# EAGLE design simplePDschematicsv3_AZ_SMD (EAGLE 7.5.0)
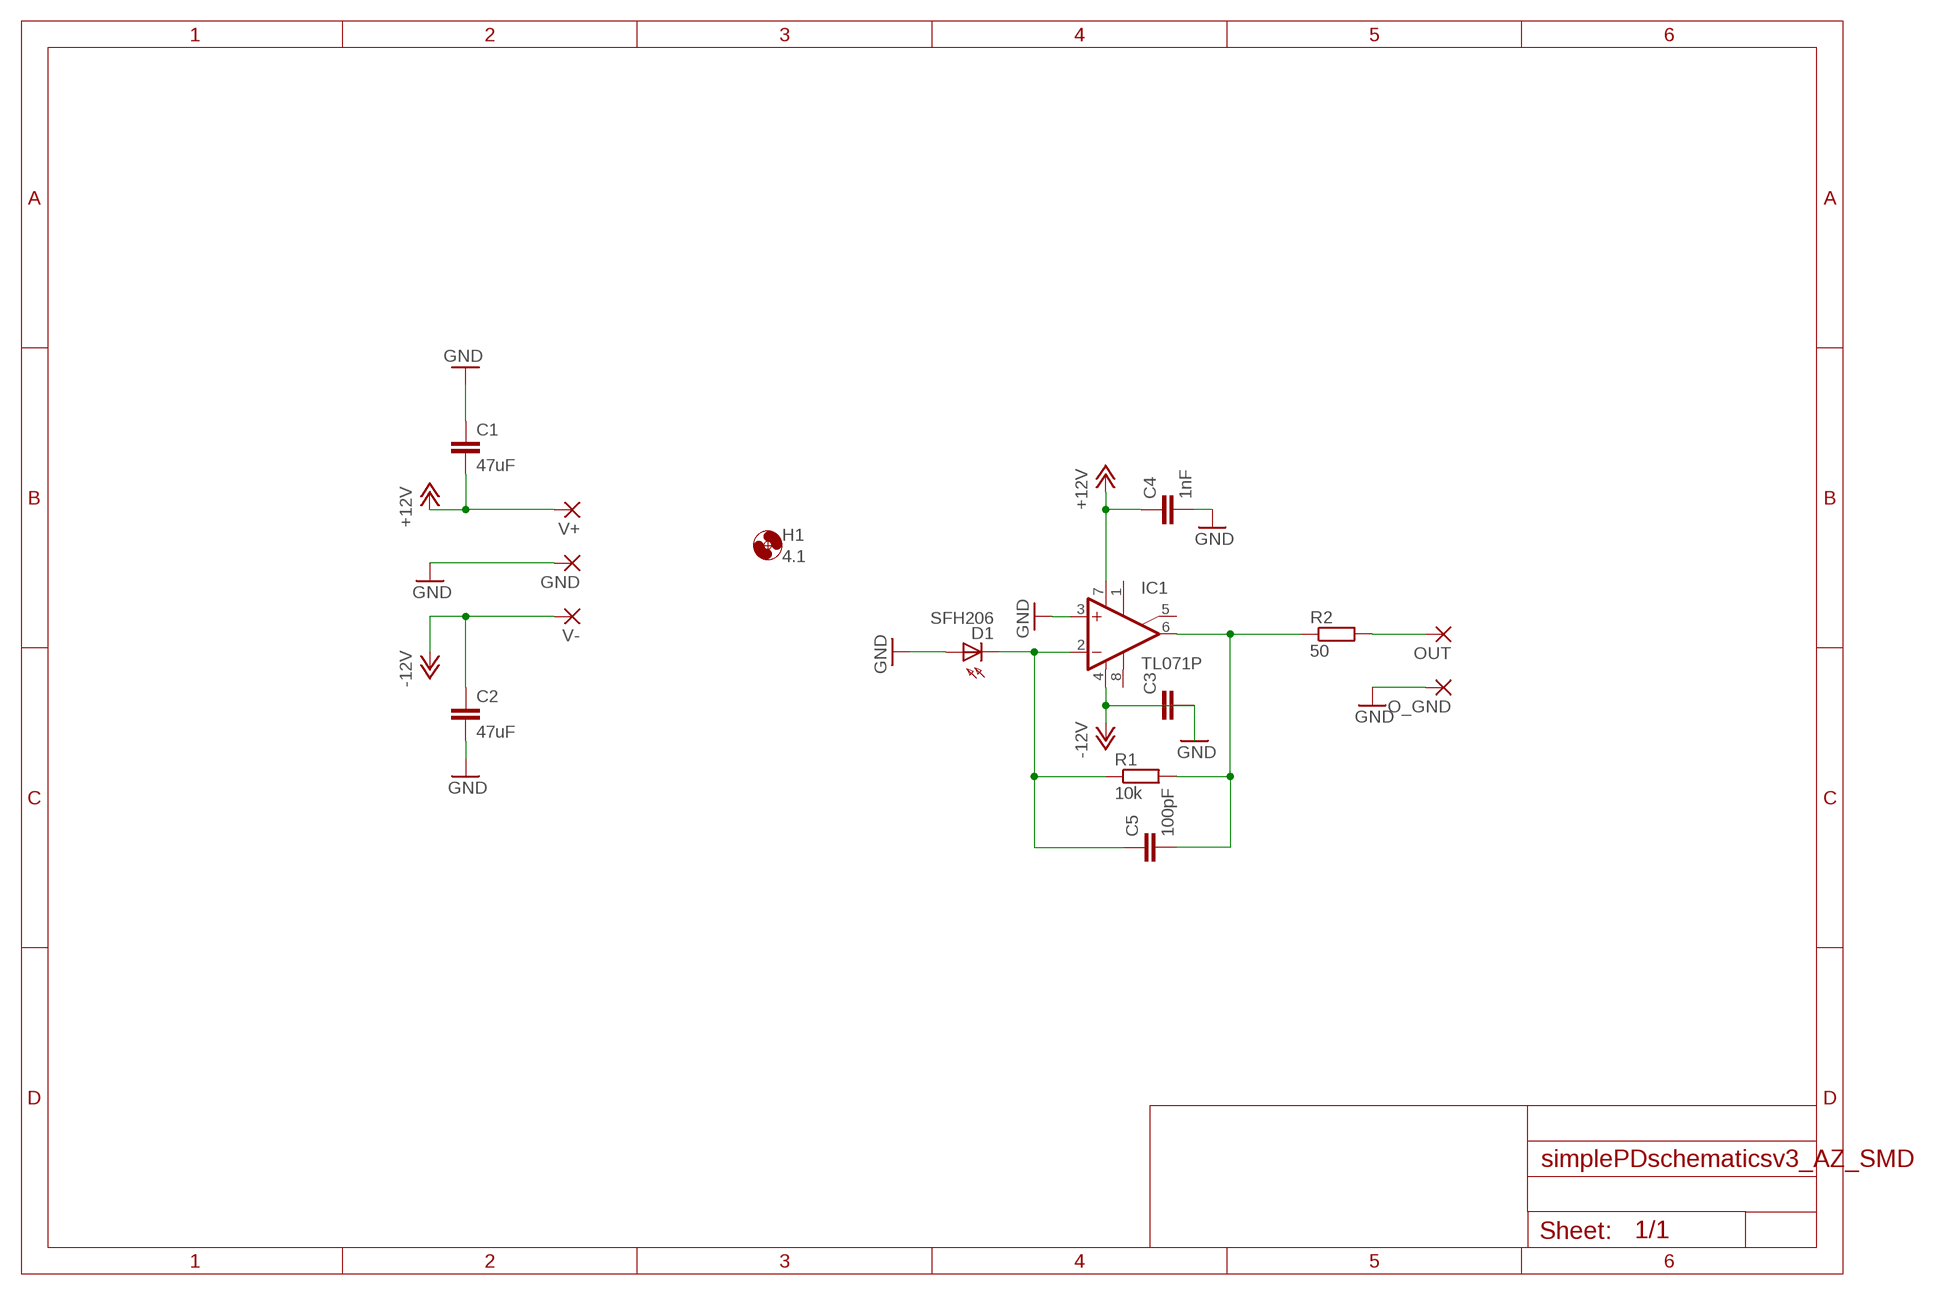
[diagram p0: schematic, sheet 1]

## Parts
C1  47uF  C-EU050-075X075  [C050-075X075]
C2  47uF  C-EU050-075X075  [C050-075X075]
C3  C-EUC0504  [C0504]
C4  1nF  C-EU025-050X050  [C025-050X050]
C5  100pF  C-EU025-050X050  [C025-050X050]
D1  SFH206  [SFH206]
GND  1,6/0,9  [1,6/0,9]
H1  4.1  MOUNT-HOLE4.1  [4,1]
IC1  TL071P  [DIL08]
O_GND  1,6/0,9  [1,6/0,9]
OUT  1,6/0,9  [1,6/0,9]
R1  10k  R-EU_M1206  [M1206]
R2  50  R-EU_M1206  [M1206]
V+  1,6/0,9  [1,6/0,9]
V-  1,6/0,9  [1,6/0,9]

## Nets
GND: C1.1 C2.2 C4.2 D1.A GND.1(P) IC1.3(+IN) O_GND.1(P)
N$1: OUT.1(P) R2.2
N$2: C5.2 IC1.6(OUT) R1.2 R2.1
N$3: C5.1 D1.K(C) IC1.2(-IN) R1.1
V+: C1.2 C4.1 IC1.7(V+) V+.1(P) ; supply symbol labelled +12V
V-: C2.1 IC1.4(V-) V-.1(P) ; supply symbol labelled -12V
Unconnected: C3.1 C3.2 IC1.1(ON1) IC1.5(ON2) IC1.8(OPT)

## Library data of the parts
C1-C5 = resistor:C-EU: CAPACITOR, European symbol
D1 = opto-trans-siemens:SFH206: PHOTO DIODE; MPN: SFH206K; OC_FARNELL: 1212741; OC_NEWARK: 01M8807
GND O_GND OUT V+ V- = wirepad:1,6/0,9: THROUGH-HOLE PAD
H1 = holes:MOUNT-HOLE: MOUNTING HOLE with drill center marker
IC1 = linear:TL071: OP AMP
R1 R2 = resistor:R-EU_: RESISTOR, European symbol

## Board
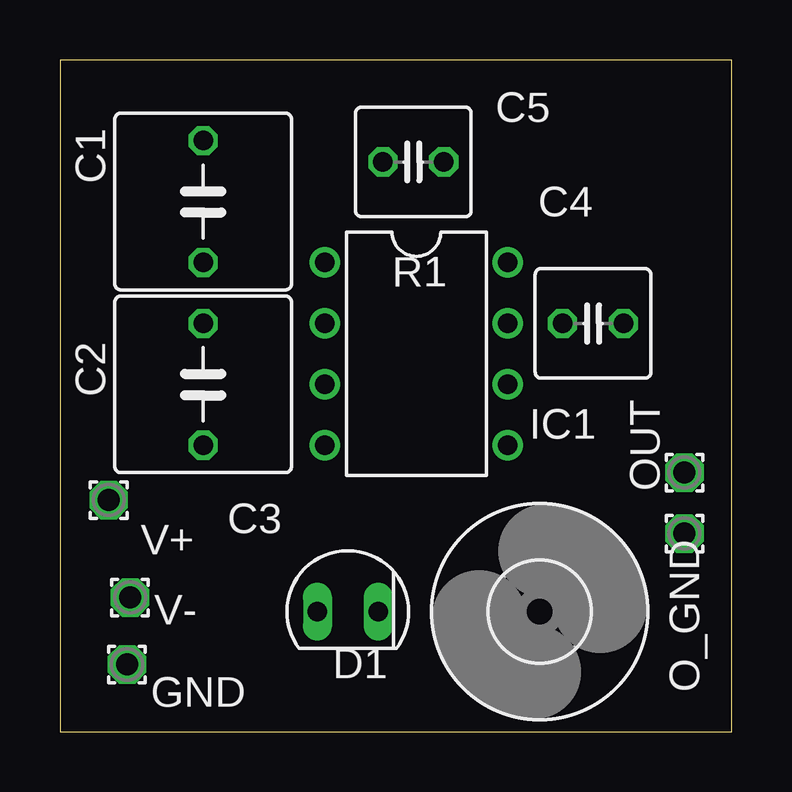
[diagram p1: board, top side]
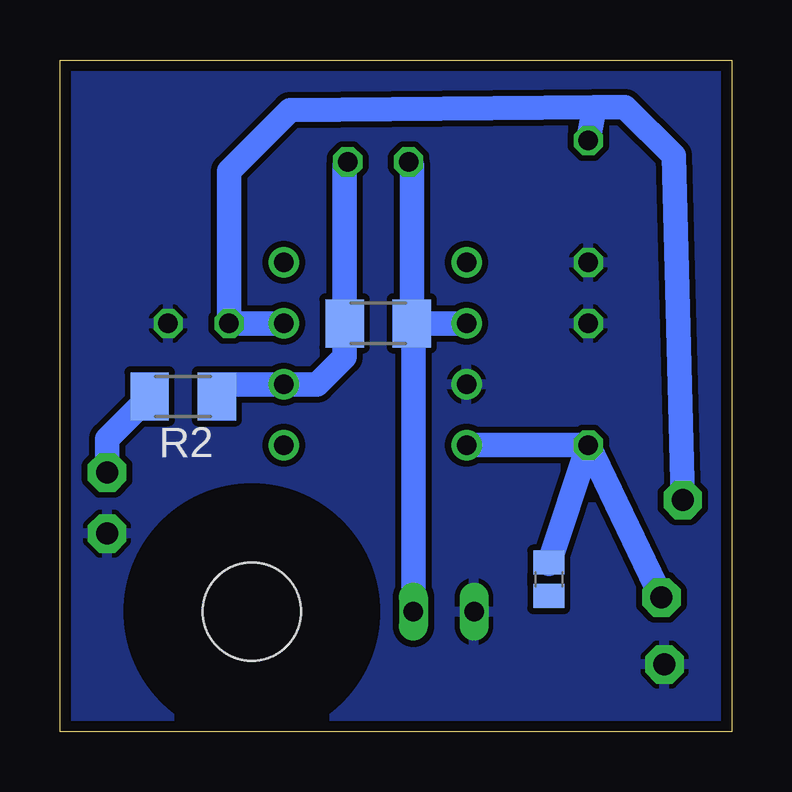
[diagram p2: board, bottom side, seen from below]

Size 28 x 28 mm. Coordinates in mm from the lower left corner, seen from the top.
Outline: 0,0 28,0 28,28 0,28 0,0
Copper layers (1*16): Top 0.018mm / dielectric 1.55mm / Bottom 0.018mm
Design rules "eC-PCB_proto-2-layer": minimum track width 0.15mm, minimum drill 0.25mm, track to track 0.15mm, track to pad 0.15mm, pad to pad 0.15mm, via to via 0.15mm, smd to smd 0.15mm, copper to edge 0.45mm, drill to drill 0.3mm, minimum pad ring 0.2mm, minimum via ring 0.2mm, stop-mask expansion 0.1mm, vias tented up to drill 0mil, thermal gap 0.2mm

### Footprints (pad centres in the part's own frame; a part is rotated, then mirrored left to right if it is on the bottom)
C050-075X075 = drill 0.813 octagon: 1 -2.54,0; 2 2.54,0
C0504 = smd 1 x 1.3: 1 -0.7,0; 2 0.7,0
C025-050X050 = drill 0.813 octagon: 1 -1.27,0; 2 1.27,0
SFH206 = drill 0.813 long: A 0,-1.27; K 0,1.27
1,6/0,9 = drill 0.914 pad 1.6 octagon: 1 0,0
4,1 = hole 4.1: 0,0
DIL08 = drill 0.813 pad 1.27: 1 -3.81,-3.81; 2 -1.27,-3.81; 3 1.27,-3.81; 4 3.81,-3.81; 5 3.81,3.81; 6 1.27,3.81; 7 -1.27,3.81; 8 -3.81,3.81
M1206 = smd 1.6 x 2: 1 -1.4,0; 2 1.4,0

### Placement (x,y rotation side)
C1  5.97,22.1 90 top
C2  5.97,14.48 90 top
C3  7.62,6.35 270 bottom
C4  22.23,17.02 0 top
C5  14.73,23.75 0 top
D1  12,5 270 top
GND  2.79,2.79 180 top
H1  20,5 0 top
IC1  14.86,15.75 270 top
O_GND  26.04,8.26 90 top
OUT  26.04,10.79 90 top
R1  14.73,17.02 180 bottom
R2  22.86,13.97 180 bottom
V+  2.03,9.65 90 top
V-  2.92,5.59 180 top

### Tracks (layer width: path | path; a pad name or v marks a point on that pad's centre or on a via)
GND
  pour Bottom (isolate 0.254): -0.38,28.32 28.19,28.32 28.19,-0.38 -0.38,-0.38
N$1
  Bottom 1.016: R2.2 26.04,12.2 OUT.1
N$2
  Bottom 1.016: C5.2 16.13,23.62 R1.2 16.13,15.62 17.27,14.48 IC1.6 21.46,14.48 R2.1
N$3
  Bottom 1.016: R1.1 IC1.2 | C5.1 13.33,23.62 R1.1 | R1.1 13.27,17.02 D1.K
V+
  Bottom 1.016: IC1.7 C4.1 20.95,23.37 18.41,25.91 5.71,26.02 | 5.71,26.02 4.45,26.04 2.41,24 V+.1 | C1.2 5.71,26.02
V-
  Bottom 1.016: C2.1 IC1.4 10.73,11.94 | C2.1 V-.1 | C2.1 7.62,6.99